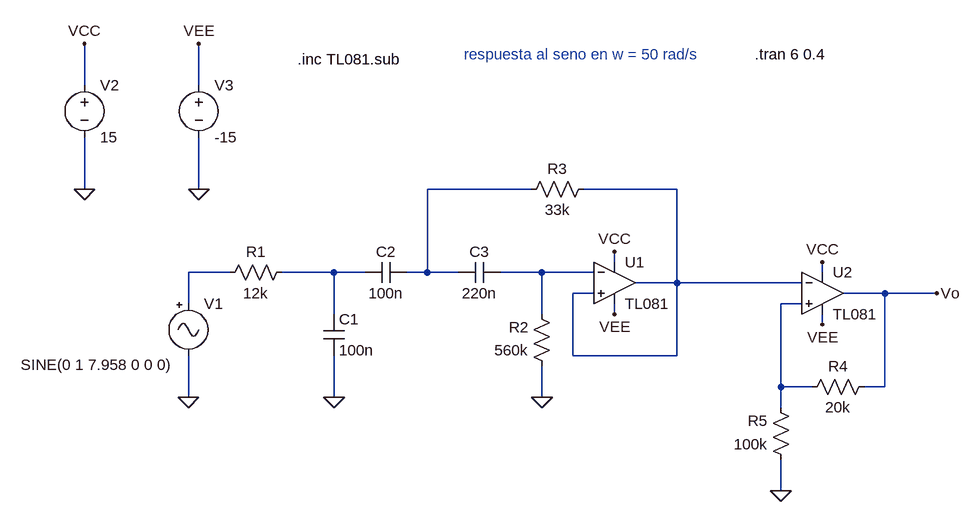
[diagram p0: schematic rtaSeno2.asc]
rtaSeno2.asc, the LTspice schematic file:
Version 4
SHEET 1 1176 704
WIRE -400 64 -400 0
WIRE -224 64 -224 0
WIRE -400 224 -400 144
WIRE -224 224 -224 144
WIRE 288 224 128 224
WIRE 512 224 368 224
WIRE 416 336 416 320
WIRE -176 352 -240 352
WIRE -16 352 -96 352
WIRE 32 352 -16 352
WIRE 128 352 128 224
WIRE 128 352 96 352
WIRE 176 352 128 352
WIRE 304 352 240 352
WIRE 384 352 304 352
WIRE 736 352 736 336
WIRE 512 368 512 224
WIRE 512 368 448 368
WIRE 704 368 512 368
WIRE 384 384 352 384
WIRE 832 384 768 384
WIRE 912 384 832 384
WIRE -240 400 -240 352
WIRE 704 400 672 400
WIRE -16 416 -16 352
WIRE 304 416 304 352
WIRE 416 416 416 400
WIRE 736 432 736 416
WIRE 352 480 352 384
WIRE 512 480 512 368
WIRE 512 480 352 480
WIRE 672 528 672 400
WIRE 720 528 672 528
WIRE 832 528 832 384
WIRE 832 528 800 528
WIRE -240 544 -240 480
WIRE -16 544 -16 480
WIRE 304 544 304 496
WIRE 672 560 672 528
WIRE 672 688 672 640
FLAG -240 544 0
FLAG -400 224 0
FLAG -400 0 VCC
FLAG -224 224 0
FLAG -224 0 VEE
FLAG -16 544 0
FLAG 304 544 0
FLAG 416 320 VCC
FLAG 416 416 VEE
FLAG 736 336 VCC
FLAG 736 432 VEE
FLAG 672 688 0
FLAG 912 384 Vo
SYMBOL Voltage -400 48 R0
SYMATTR InstName V2
SYMATTR Value 15
SYMBOL Voltage -224 48 R0
SYMATTR InstName V3
SYMATTR Value -15
SYMBOL Misc/signal -240 384 R0
WINDOW 3 -258 110 Left 2
SYMATTR Value SINE(0 1 7.958 0 0 0)
SYMATTR InstName V1
SYMBOL Cap -32 416 R0
SYMATTR InstName C1
SYMATTR Value 100n
SYMATTR SpiceLine IC=0
SYMBOL Cap 96 336 R90
WINDOW 0 0 32 VBottom 2
WINDOW 3 32 32 VTop 2
SYMATTR InstName C2
SYMATTR Value 100n
SYMATTR SpiceLine IC=0
SYMBOL Cap 240 336 R90
WINDOW 0 0 32 VBottom 2
WINDOW 3 32 32 VTop 2
SYMATTR InstName C3
SYMATTR Value 220n
SYMATTR SpiceLine IC=0
SYMBOL Res -80 336 R90
WINDOW 0 0 56 VBottom 2
WINDOW 3 32 56 VTop 2
SYMATTR InstName R1
SYMATTR Value 12k
SYMBOL Res 320 512 R180
WINDOW 0 36 76 Left 2
WINDOW 3 36 40 Left 2
SYMATTR InstName R2
SYMATTR Value 560k
SYMBOL Res 272 240 R270
WINDOW 0 32 56 VTop 2
WINDOW 3 0 56 VBottom 2
SYMATTR InstName R3
SYMATTR Value 33k
SYMBOL OpAmps/opamp2 416 304 R0
SYMATTR InstName U1
SYMATTR Value TL081
SYMBOL OpAmps/opamp2 736 320 R0
SYMATTR InstName U2
SYMATTR Value TL081
SYMBOL Res 816 512 R90
WINDOW 0 0 56 VBottom 2
WINDOW 3 32 56 VTop 2
SYMATTR InstName R4
SYMATTR Value 20k
SYMBOL Res 688 656 R180
WINDOW 0 36 76 Left 2
WINDOW 3 36 40 Left 2
SYMATTR InstName R5
SYMATTR Value 100k
TEXT -72 24 Left 2 !.inc TL081.sub
TEXT 632 16 Left 2 !.tran 6 0.4
TEXT 184 16 Left 2 ;respuesta al seno en w = 50 rad/s

The netlist it stands for:
* rtaSeno2.asc
V2 VCC 0 15
V3 VEE 0 -15
V1 N003 0 SINE(0 1 7.958 0 0 0)
C1 N004 0 100n IC=0
C2 N001 N004 100n IC=0
C3 N005 N001 220n IC=0
R1 N004 N003 12k
R2 0 N005 560k
R3 N001 N002 33k
XU1 N002 N005 VCC VEE N002 TL081  ; pins In+ In- V+ V- OUT
XU2 N006 N002 VCC VEE Vo TL081  ; pins In+ In- V+ V- OUT
R4 Vo N006 20k
R5 0 N006 100k
.inc TL081.sub
.tran 6 0.4
* respuesta al seno en w = 50 rad/s
.backanno
.end